# EAGLE schematic bluepill-breakout (EAGLE 9.6.2)

## Sheet 1 of 2
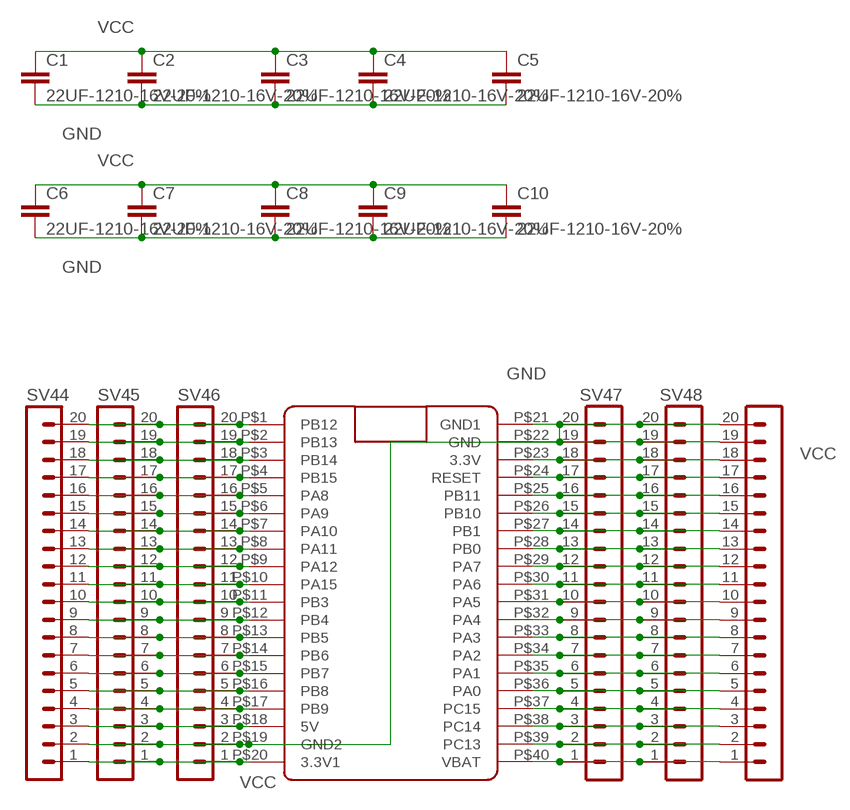
[diagram p0: schematic, sheet 1]

### Parts
C1  22UF-1210-16V-20%  [1210]
C2  22UF-1210-16V-20%  [1210]
C3  22UF-1210-16V-20%  [1210]
C4  22UF-1210-16V-20%  [1210]
C5  22UF-1210-16V-20%  [1210]
C6  22UF-1210-16V-20%  [1210]
C7  22UF-1210-16V-20%  [1210]
C8  22UF-1210-16V-20%  [1210]
C9  22UF-1210-16V-20%  [1210]
C10  22UF-1210-16V-20%  [1210]
SV44  MA20-1  [MA20-1]
SV45  MA20-1  [MA20-1]
SV46  MA20-1  [MA20-1]
SV47  MA20-1  [MA20-1]
SV48  MA20-1  [MA20-1]
SV50  MA20-1  [MA20-1]
U$1  BLUE_PILLADVANCED  [BLUE_PILL_ADV]

### Nets
GND: C1.2 C2.2 C3.2 C4.2 C5.2 C6.2 C7.2 C8.2 C9.2 C10.2 SV44.2 SV45.2 SV46.2 SV47.19 SV47.20 SV48.19 SV48.20 SV50.19 SV50.20 U$1.P$19(GND2) U$1.P$21(GND1) U$1.P$22(GND) ; also sheet 2
N$203: SV44.3 SV45.3 SV46.3 U$1.P$18(5V)
N$204: SV44.4 SV45.4 SV46.4 U$1.P$17(PB9)
N$205: SV44.5 SV45.5 SV46.5 U$1.P$16(PB8)
N$206: SV44.6 SV45.6 SV46.6 U$1.P$15(PB7)
N$207: SV44.7 SV45.7 SV46.7 U$1.P$14(PB6)
N$208: SV44.8 SV45.8 SV46.8 U$1.P$13(PB5)
N$209: SV44.9 SV45.9 SV46.9 U$1.P$12(PB4)
N$210: SV44.10 SV45.10 SV46.10 U$1.P$11(PB3)
N$211: SV44.11 SV45.11 SV46.11 U$1.P$10(PA15)
N$212: SV44.12 SV45.12 SV46.12 U$1.P$9(PA12)
N$213: SV44.13 SV45.13 SV46.13 U$1.P$8(PA11)
N$214: SV44.14 SV45.14 SV46.14 U$1.P$7(PA10)
N$215: SV44.15 SV45.15 SV46.15 U$1.P$6(PA9)
N$216: SV44.16 SV45.16 SV46.16 U$1.P$5(PA8)
N$217: SV44.17 SV45.17 SV46.17 U$1.P$4(PB15)
N$218: SV44.18 SV45.18 SV46.18 U$1.P$3(PB14)
N$219: SV44.19 SV45.19 SV46.19 U$1.P$2(PB13)
N$220: SV44.20 SV45.20 SV46.20 U$1.P$1(PB12)
N$221: SV47.1 SV48.1 SV50.1 U$1.P$40(VBAT)
N$222: SV47.2 SV48.2 SV50.2 U$1.P$39(PC13)
N$223: SV47.3 SV48.3 SV50.3 U$1.P$38(PC14)
N$224: SV47.4 SV48.4 SV50.4 U$1.P$37(PC15)
N$225: SV47.5 SV48.5 SV50.5 U$1.P$36(PA0)
N$226: SV47.6 SV48.6 SV50.6 U$1.P$35(PA1)
N$227: SV47.7 SV48.7 SV50.7 U$1.P$34(PA2)
N$228: SV47.8 SV48.8 SV50.8 U$1.P$33(PA3)
N$229: SV47.9 SV48.9 SV50.9 U$1.P$32(PA4)
N$230: SV47.10 SV48.10 SV50.10 U$1.P$31(PA5)
N$231: SV47.11 SV48.11 SV50.11 U$1.P$30(PA6)
N$232: SV47.12 SV48.12 SV50.12 U$1.P$29(PA7)
N$233: SV47.13 SV48.13 SV50.13 U$1.P$28(PB0)
N$234: SV47.14 SV48.14 SV50.14 U$1.P$27(PB1)
N$235: SV47.15 SV48.15 SV50.15 U$1.P$26(PB10)
N$236: SV47.16 SV48.16 SV50.16 U$1.P$25(PB11)
N$237: SV47.17 SV48.17 SV50.17 U$1.P$24(RESET)
VCC: C1.1 C2.1 C3.1 C4.1 C5.1 C6.1 C7.1 C8.1 C9.1 C10.1 SV44.1 SV45.1 SV46.1 SV47.18 SV48.18 SV50.18 U$1.P$20(3.3V1) U$1.P$23(3.3V) ; also sheet 2

## Sheet 2 of 2
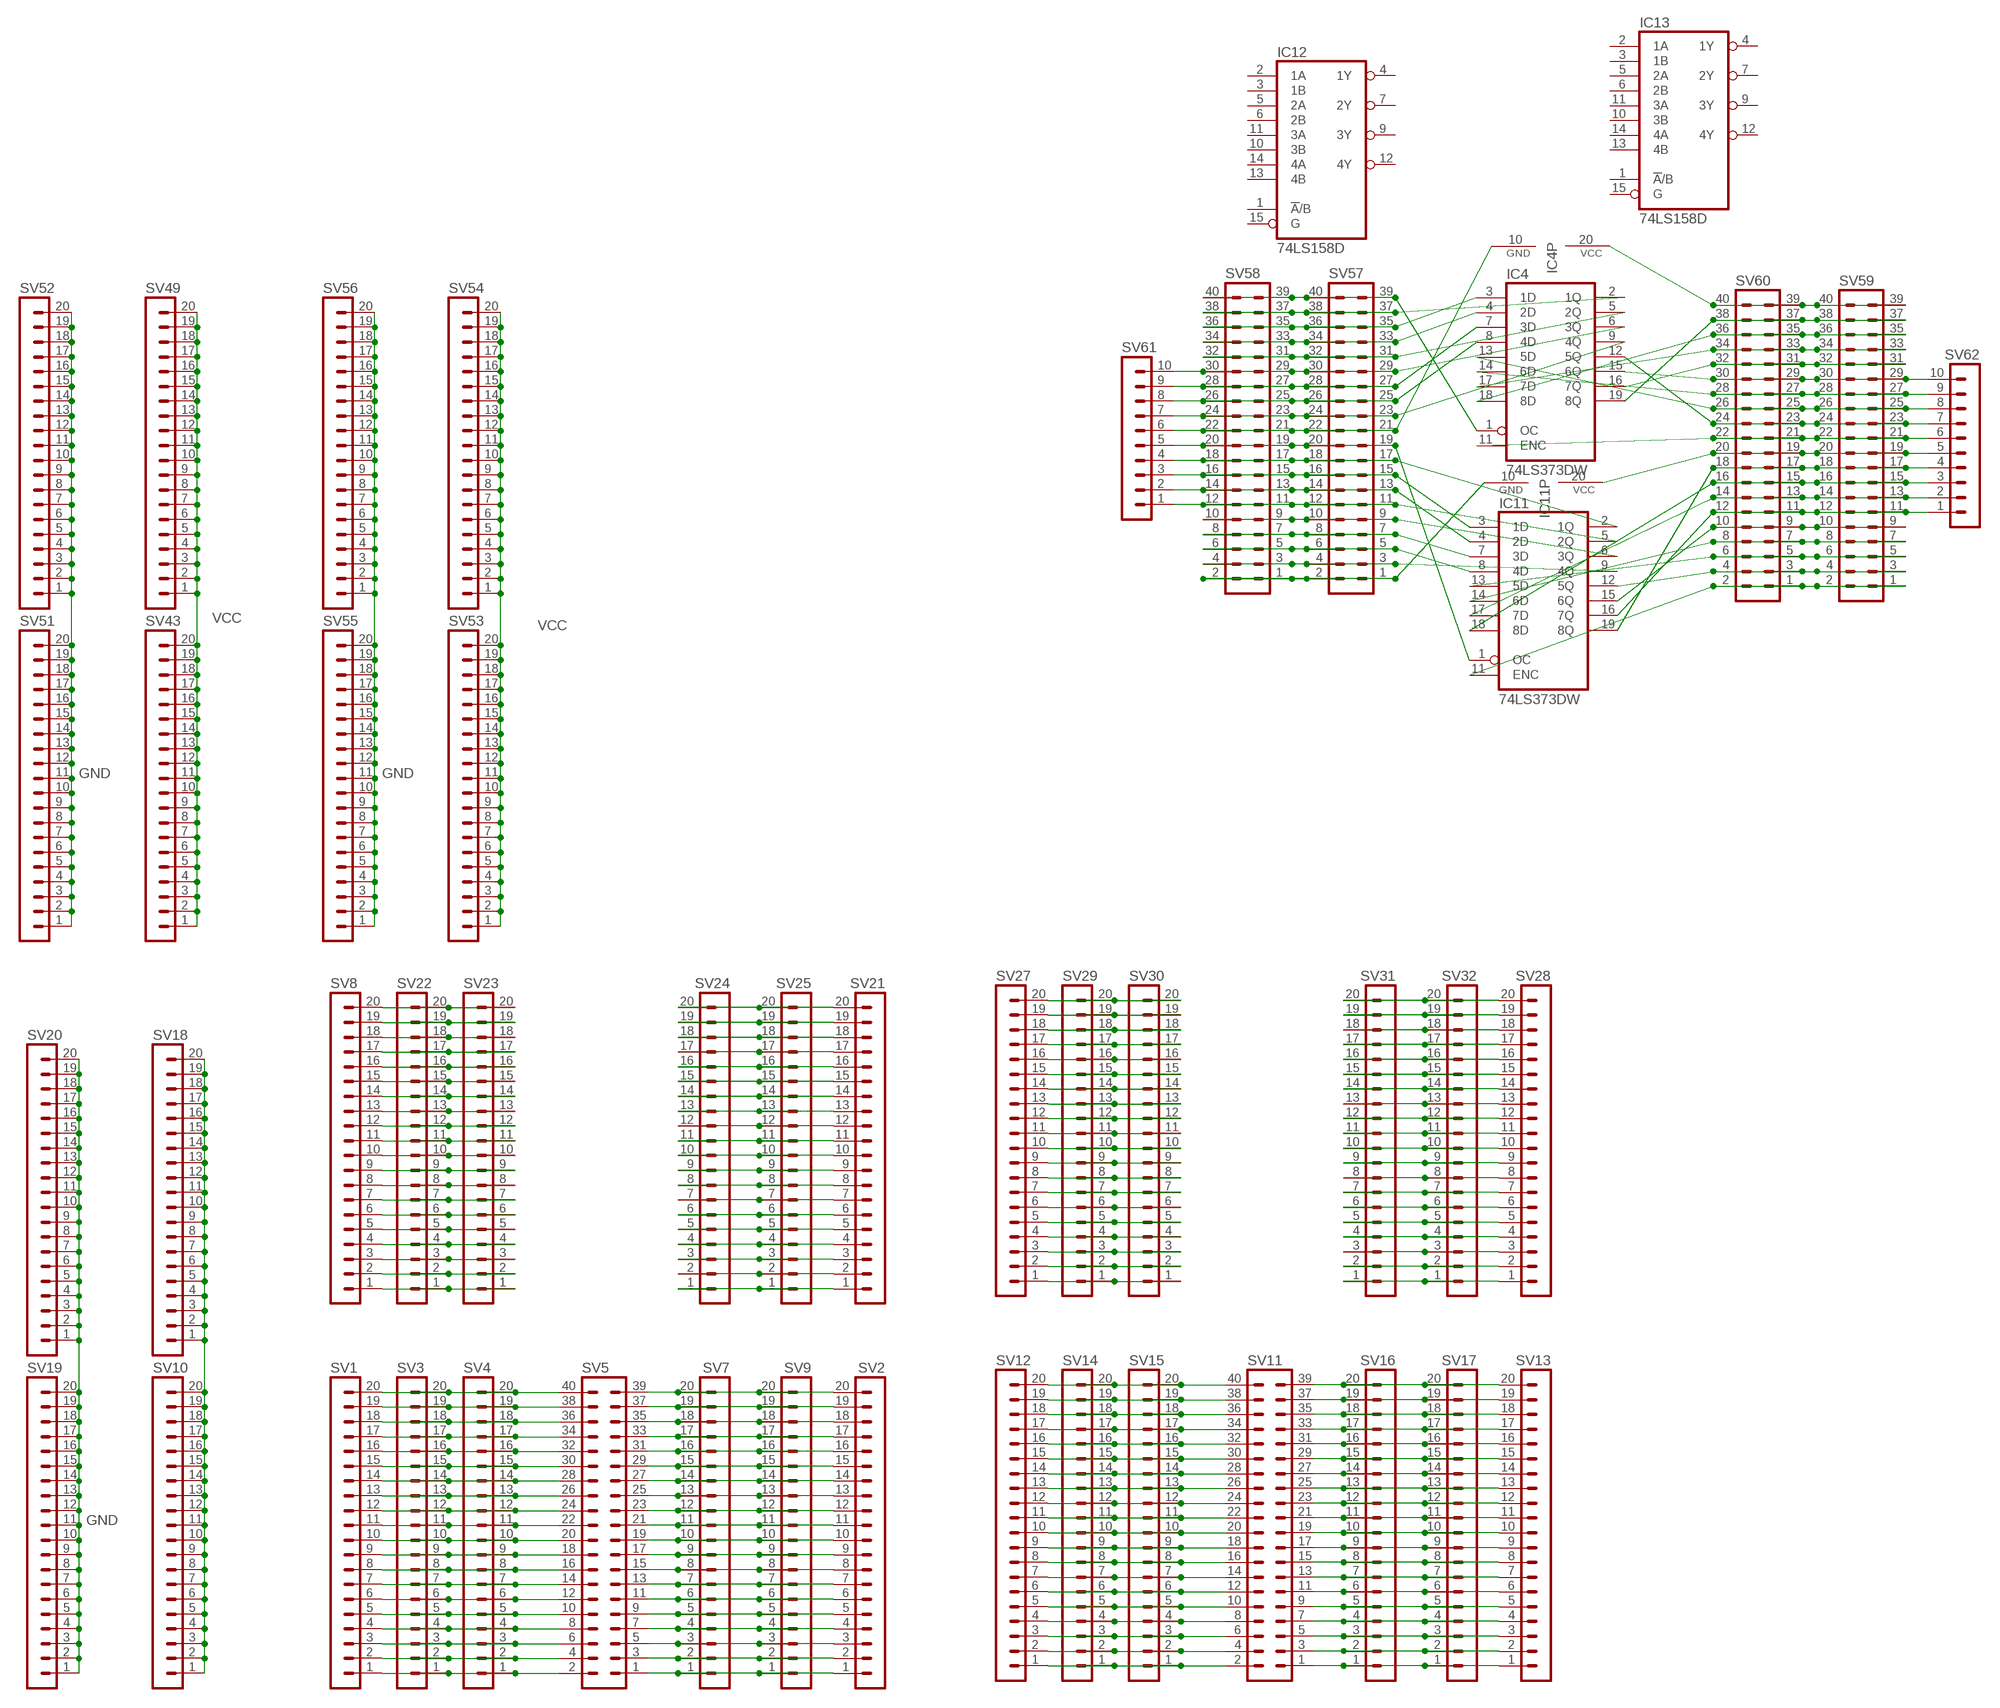
[diagram p1: schematic, sheet 2, part 1 of 2]
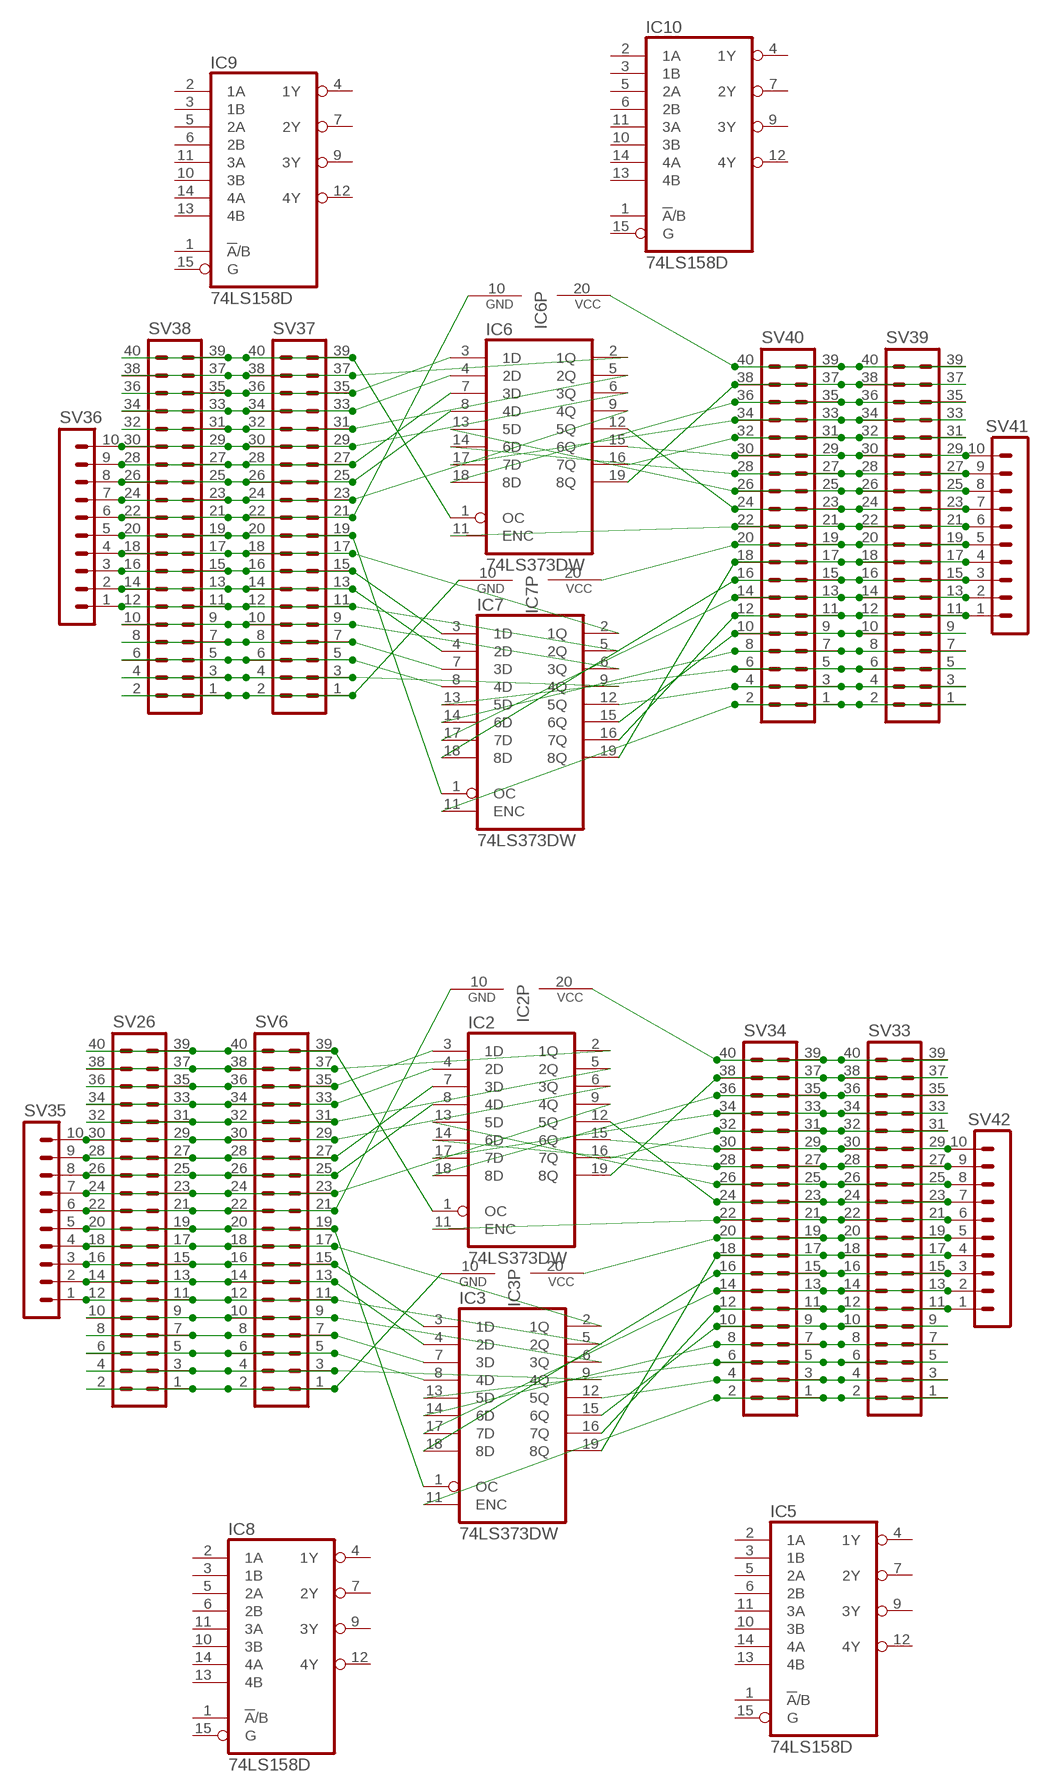
[diagram p2: schematic, sheet 2, part 2 of 2]

### Parts
IC2  74LS373DW  [SO20W]
IC3  74LS373DW  [SO20W]
IC4  74LS373DW  [SO20W]
IC5  74LS158D  [SO16]
IC6  74LS373DW  [SO20W]
IC7  74LS373DW  [SO20W]
IC8  74LS158D  [SO16]
IC9  74LS158D  [SO16]
IC10  74LS158D  [SO16]
IC11  74LS373DW  [SO20W]
IC12  74LS158D  [SO16]
IC13  74LS158D  [SO16]
SV1  MA20-1  [MA20-1]
SV2  MA20-1  [MA20-1]
SV3  MA20-1  [MA20-1]
SV4  MA20-1  [MA20-1]
SV5  MA20-2  [MA20-2]
SV6  MA20-2  [MA20-2]
SV7  MA20-1  [MA20-1]
SV8  MA20-1  [MA20-1]
SV9  MA20-1  [MA20-1]
SV10  MA20-1  [MA20-1]
SV11  MA20-2  [MA20-2]
SV12  MA20-1  [MA20-1]
SV13  MA20-1  [MA20-1]
SV14  MA20-1  [MA20-1]
SV15  MA20-1  [MA20-1]
SV16  MA20-1  [MA20-1]
SV17  MA20-1  [MA20-1]
SV18  MA20-1  [MA20-1]
SV19  MA20-1  [MA20-1]
SV20  MA20-1  [MA20-1]
SV21  MA20-1  [MA20-1]
SV22  MA20-1  [MA20-1]
SV23  MA20-1  [MA20-1]
SV24  MA20-1  [MA20-1]
SV25  MA20-1  [MA20-1]
SV26  MA20-2  [MA20-2]
SV27  MA20-1  [MA20-1]
SV28  MA20-1  [MA20-1]
SV29  MA20-1  [MA20-1]
SV30  MA20-1  [MA20-1]
SV31  MA20-1  [MA20-1]
SV32  MA20-1  [MA20-1]
SV33  MA20-2  [MA20-2]
SV34  MA20-2  [MA20-2]
SV35  MA10-1  [MA10-1]
SV36  MA10-1  [MA10-1]
SV37  MA20-2  [MA20-2]
SV38  MA20-2  [MA20-2]
SV39  MA20-2  [MA20-2]
SV40  MA20-2  [MA20-2]
SV41  MA10-1  [MA10-1]
SV42  MA10-1  [MA10-1]
SV43  MA20-1  [MA20-1]
SV49  MA20-1  [MA20-1]
SV51  MA20-1  [MA20-1]
SV52  MA20-1  [MA20-1]
SV53  MA20-1  [MA20-1]
SV54  MA20-1  [MA20-1]
SV55  MA20-1  [MA20-1]
SV56  MA20-1  [MA20-1]
SV57  MA20-2  [MA20-2]
SV58  MA20-2  [MA20-2]
SV59  MA20-2  [MA20-2]
SV60  MA20-2  [MA20-2]
SV61  MA10-1  [MA10-1]
SV62  MA10-1  [MA10-1]

### Nets
GND: SV19.1 SV19.2 SV19.3 SV19.4 SV19.5 SV19.6 SV19.7 SV19.8 SV19.9 SV19.10 SV19.11 SV19.12 SV19.13 SV19.14 SV19.15 SV19.16 SV19.17 SV19.18 SV19.19 SV19.20 SV20.1 SV20.2 SV20.3 SV20.4 SV20.5 SV20.6 SV20.7 SV20.8 SV20.9 SV20.10 SV20.11 SV20.12 SV20.13 SV20.14 SV20.15 SV20.16 SV20.17 SV20.18 SV20.19 SV20.20 SV51.1 SV51.2 SV51.3 SV51.4 SV51.5 SV51.6 SV51.7 SV51.8 SV51.9 SV51.10 SV51.11 SV51.12 SV51.13 SV51.14 SV51.15 SV51.16 SV51.17 SV51.18 SV51.19 SV51.20 SV52.1 SV52.2 SV52.3 SV52.4 SV52.5 SV52.6 SV52.7 SV52.8 SV52.9 SV52.10 SV52.11 SV52.12 SV52.13 SV52.14 SV52.15 SV52.16 SV52.17 SV52.18 SV52.19 SV52.20 SV55.1 SV55.2 SV55.3 SV55.4 SV55.5 SV55.6 SV55.7 SV55.8 SV55.9 SV55.10 SV55.11 SV55.12 SV55.13 SV55.14 SV55.15 SV55.16 SV55.17 SV55.18 SV55.19 SV55.20 SV56.1 SV56.2 SV56.3 SV56.4 SV56.5 SV56.6 SV56.7 SV56.8 SV56.9 SV56.10 SV56.11 SV56.12 SV56.13 SV56.14 SV56.15 SV56.16 SV56.17 SV56.18 SV56.19 SV56.20 ; also sheet 1
N$1: SV1.1 SV3.1 SV4.1 SV5.2
N$2: SV1.2 SV3.2 SV4.2 SV5.4
N$3: SV1.3 SV3.3 SV4.3 SV5.6
N$4: SV1.4 SV3.4 SV4.4 SV5.8
N$5: SV1.5 SV3.5 SV4.5 SV5.10
N$6: SV1.6 SV3.6 SV4.6 SV5.12
N$7: SV1.7 SV3.7 SV4.7 SV5.14
N$8: SV1.8 SV3.8 SV4.8 SV5.16
N$9: SV1.9 SV3.9 SV4.9 SV5.18
N$10: SV1.10 SV3.10 SV4.10 SV5.20
N$11: SV1.11 SV3.11 SV4.11 SV5.22
N$12: SV1.12 SV3.12 SV4.12 SV5.24
N$13: SV1.13 SV3.13 SV4.13 SV5.26
N$14: SV1.14 SV3.14 SV4.14 SV5.28
N$15: SV1.15 SV3.15 SV4.15 SV5.30
N$16: SV1.16 SV3.16 SV4.16 SV5.32
N$17: SV1.17 SV3.17 SV4.17 SV5.34
N$18: SV1.18 SV3.18 SV4.18 SV5.36
N$19: SV1.19 SV3.19 SV4.19 SV5.38
N$20: SV1.20 SV3.20 SV4.20 SV5.40
N$21: SV2.1 SV5.1 SV7.1 SV9.1
N$22: SV2.2 SV5.3 SV7.2 SV9.2
N$23: SV2.3 SV5.5 SV7.3 SV9.3
N$24: SV2.4 SV5.7 SV7.4 SV9.4
N$25: SV2.5 SV5.9 SV7.5 SV9.5
N$26: SV2.6 SV5.11 SV7.6 SV9.6
N$27: SV2.7 SV5.13 SV7.7 SV9.7
N$28: SV2.8 SV5.15 SV7.8 SV9.8
N$29: SV2.9 SV5.17 SV7.9 SV9.9
N$30: SV2.10 SV5.19 SV7.10 SV9.10
N$31: SV2.11 SV5.21 SV7.11 SV9.11
N$32: SV2.12 SV5.23 SV7.12 SV9.12
N$33: SV2.13 SV5.25 SV7.13 SV9.13
N$34: SV2.14 SV5.27 SV7.14 SV9.14
N$35: SV2.15 SV5.29 SV7.15 SV9.15
N$36: SV2.16 SV5.31 SV7.16 SV9.16
N$37: SV2.17 SV5.33 SV7.17 SV9.17
N$38: SV2.18 SV5.35 SV7.18 SV9.18
N$39: SV2.19 SV5.37 SV7.19 SV9.19
N$40: SV2.20 SV5.39 SV7.20 SV9.20
N$41: SV11.2 SV12.1 SV14.1 SV15.1
N$42: SV11.4 SV12.2 SV14.2 SV15.2
N$43: SV11.6 SV12.3 SV14.3 SV15.3
N$44: SV11.8 SV12.4 SV14.4 SV15.4
N$45: SV11.10 SV12.5 SV14.5 SV15.5
N$46: SV11.12 SV12.6 SV14.6 SV15.6
N$47: SV11.14 SV12.7 SV14.7 SV15.7
N$48: SV11.16 SV12.8 SV14.8 SV15.8
N$49: SV11.18 SV12.9 SV14.9 SV15.9
N$50: SV11.20 SV12.10 SV14.10 SV15.10
N$51: SV11.22 SV12.11 SV14.11 SV15.11
N$52: SV11.24 SV12.12 SV14.12 SV15.12
N$53: SV11.26 SV12.13 SV14.13 SV15.13
N$54: SV11.28 SV12.14 SV14.14 SV15.14
N$55: SV11.30 SV12.15 SV14.15 SV15.15
N$56: SV11.32 SV12.16 SV14.16 SV15.16
N$57: SV11.34 SV12.17 SV14.17 SV15.17
N$58: SV11.36 SV12.18 SV14.18 SV15.18
N$59: SV11.38 SV12.19 SV14.19 SV15.19
N$60: SV11.40 SV12.20 SV14.20 SV15.20
N$61: SV11.1 SV13.1 SV16.1 SV17.1
N$62: SV11.3 SV13.2 SV16.2 SV17.2
N$63: SV11.5 SV13.3 SV16.3 SV17.3
N$64: SV11.7 SV13.4 SV16.4 SV17.4
N$65: SV11.9 SV13.5 SV16.5 SV17.5
N$66: SV11.11 SV13.6 SV16.6 SV17.6
N$67: SV11.13 SV13.7 SV16.7 SV17.7
N$68: SV11.15 SV13.8 SV16.8 SV17.8
N$69: SV11.17 SV13.9 SV16.9 SV17.9
N$70: SV11.19 SV13.10 SV16.10 SV17.10
N$71: SV11.21 SV13.11 SV16.11 SV17.11
N$72: SV11.23 SV13.12 SV16.12 SV17.12
N$73: SV11.25 SV13.13 SV16.13 SV17.13
N$74: SV11.27 SV13.14 SV16.14 SV17.14
N$75: SV11.29 SV13.15 SV16.15 SV17.15
N$76: SV11.31 SV13.16 SV16.16 SV17.16
N$77: SV11.33 SV13.17 SV16.17 SV17.17
N$78: SV11.35 SV13.18 SV16.18 SV17.18
N$79: SV11.37 SV13.19 SV16.19 SV17.19
N$80: SV11.39 SV13.20 SV16.20 SV17.20
N$81: SV8.1 SV22.1 SV23.1
N$82: SV8.2 SV22.2 SV23.2
N$83: SV8.3 SV22.3 SV23.3
N$84: SV8.4 SV22.4 SV23.4
N$85: SV8.5 SV22.5 SV23.5
N$86: SV8.6 SV22.6 SV23.6
N$87: SV8.7 SV22.7 SV23.7
N$88: SV8.8 SV22.8 SV23.8
N$89: SV8.9 SV22.9 SV23.9
N$90: SV8.10 SV22.10 SV23.10
N$91: SV8.11 SV22.11 SV23.11
N$92: SV8.12 SV22.12 SV23.12
N$93: SV8.13 SV22.13 SV23.13
N$94: SV8.14 SV22.14 SV23.14
N$95: SV8.15 SV22.15 SV23.15
N$96: SV8.16 SV22.16 SV23.16
N$97: SV8.17 SV22.17 SV23.17
N$98: SV8.18 SV22.18 SV23.18
N$99: SV8.19 SV22.19 SV23.19
N$100: SV8.20 SV22.20 SV23.20
N$101: SV21.1 SV24.1 SV25.1
N$102: SV21.2 SV24.2 SV25.2
N$103: SV21.3 SV24.3 SV25.3
N$104: SV21.4 SV24.4 SV25.4
N$105: SV21.5 SV24.5 SV25.5
N$106: SV21.6 SV24.6 SV25.6
N$107: SV21.7 SV24.7 SV25.7
N$108: SV21.8 SV24.8 SV25.8
N$109: SV21.9 SV24.9 SV25.9
N$110: SV21.10 SV24.10 SV25.10
N$111: SV21.11 SV24.11 SV25.11
N$112: SV21.12 SV24.12 SV25.12
N$113: SV21.13 SV24.13 SV25.13
N$114: SV21.14 SV24.14 SV25.14
N$115: SV21.15 SV24.15 SV25.15
N$116: SV21.16 SV24.16 SV25.16
N$117: SV21.17 SV24.17 SV25.17
N$118: SV21.18 SV24.18 SV25.18
N$119: SV21.19 SV24.19 SV25.19
N$120: SV21.20 SV24.20 SV25.20
N$121: SV27.1 SV29.1 SV30.1
N$122: SV27.2 SV29.2 SV30.2
N$123: SV27.3 SV29.3 SV30.3
N$124: SV27.4 SV29.4 SV30.4
N$125: SV27.5 SV29.5 SV30.5
N$126: SV27.6 SV29.6 SV30.6
N$127: SV27.7 SV29.7 SV30.7
N$128: SV27.8 SV29.8 SV30.8
N$129: SV27.9 SV29.9 SV30.9
N$130: SV27.10 SV29.10 SV30.10
N$131: SV27.11 SV29.11 SV30.11
N$132: SV27.12 SV29.12 SV30.12
N$133: SV27.13 SV29.13 SV30.13
N$134: SV27.14 SV29.14 SV30.14
N$135: SV27.15 SV29.15 SV30.15
N$136: SV27.16 SV29.16 SV30.16
N$137: SV27.17 SV29.17 SV30.17
N$138: SV27.18 SV29.18 SV30.18
N$139: SV27.19 SV29.19 SV30.19
N$140: SV27.20 SV29.20 SV30.20
N$141: SV28.1 SV31.1 SV32.1
N$142: SV28.2 SV31.2 SV32.2
N$143: SV28.3 SV31.3 SV32.3
N$144: SV28.4 SV31.4 SV32.4
N$145: SV28.5 SV31.5 SV32.5
N$146: SV28.6 SV31.6 SV32.6
N$147: SV28.7 SV31.7 SV32.7
N$148: SV28.8 SV31.8 SV32.8
N$149: SV28.9 SV31.9 SV32.9
N$150: SV28.10 SV31.10 SV32.10
N$151: SV28.11 SV31.11 SV32.11
N$152: SV28.12 SV31.12 SV32.12
N$153: SV28.13 SV31.13 SV32.13
N$154: SV28.14 SV31.14 SV32.14
N$155: SV28.15 SV31.15 SV32.15
N$156: SV28.16 SV31.16 SV32.16
N$157: SV28.17 SV31.17 SV32.17
N$158: SV28.18 SV31.18 SV32.18
N$159: SV28.19 SV31.19 SV32.19
N$160: SV28.20 SV31.20 SV32.20
N$161: IC3.10(GND) SV6.1 SV6.2 SV26.1 SV26.2
N$162: IC3.9(4Q) SV6.3 SV6.4 SV26.3 SV26.4
N$163: IC3.8(4D) SV6.5 SV6.6 SV26.5 SV26.6
N$164: IC3.7(3D) SV6.7 SV6.8 SV26.7 SV26.8
N$165: IC3.6(3Q) SV6.9 SV6.10 SV26.9 SV26.10
N$166: IC3.5(2Q) SV6.11 SV6.12 SV26.11 SV26.12 SV35.1
N$167: IC3.4(2D) SV6.13 SV6.14 SV26.13 SV26.14 SV35.2
N$168: IC3.3(1D) SV6.15 SV6.16 SV26.15 SV26.16 SV35.3
N$169: IC3.2(1Q) SV6.17 SV6.18 SV26.17 SV26.18 SV35.4
N$170: IC3.1(OC) SV6.19 SV6.20 SV26.19 SV26.20 SV35.5
N$171: IC2.10(GND) SV6.21 SV6.22 SV26.21 SV26.22 SV35.6
N$172: IC2.9(4Q) SV6.23 SV6.24 SV26.23 SV26.24 SV35.7
N$173: IC2.8(4D) SV6.25 SV6.26 SV26.25 SV26.26 SV35.8
N$174: IC2.7(3D) SV6.27 SV6.28 SV26.27 SV26.28 SV35.9
N$175: IC2.6(3Q) SV6.29 SV6.30 SV26.29 SV26.30 SV35.10
N$176: IC2.5(2Q) SV6.31 SV6.32 SV26.31 SV26.32
N$177: IC2.4(2D) SV6.33 SV6.34 SV26.33 SV26.34
N$178: IC2.3(1D) SV6.35 SV6.36 SV26.35 SV26.36
N$179: IC2.2(1Q) SV6.37 SV6.38 SV26.37 SV26.38
N$180: IC2.1(OC) SV6.39 SV6.40 SV26.39 SV26.40
N$181: IC3.11(ENC) SV33.1 SV33.2 SV34.1 SV34.2
N$182: IC3.12(5Q) SV33.3 SV33.4 SV34.3 SV34.4
N$183: IC3.13(5D) SV33.5 SV33.6 SV34.5 SV34.6
N$184: IC3.14(6D) SV33.7 SV33.8 SV34.7 SV34.8
N$185: IC3.15(6Q) SV33.9 SV33.10 SV34.9 SV34.10
N$186: IC3.16(7Q) SV33.11 SV33.12 SV34.11 SV34.12 SV42.1
N$187: IC3.17(7D) SV33.13 SV33.14 SV34.13 SV34.14 SV42.2
N$188: IC3.18(8D) SV33.15 SV33.16 SV34.15 SV34.16 SV42.3
N$189: IC3.19(8Q) SV33.17 SV33.18 SV34.17 SV34.18 SV42.4
N$190: IC3.20(VCC) SV33.19 SV33.20 SV34.19 SV34.20 SV42.5
N$191: IC2.11(ENC) SV33.21 SV33.22 SV34.21 SV34.22 SV42.6
N$192: IC2.12(5Q) SV33.23 SV33.24 SV34.23 SV34.24 SV42.7
N$193: IC2.13(5D) SV33.25 SV33.26 SV34.25 SV34.26 SV42.8
N$194: IC2.14(6D) SV33.27 SV33.28 SV34.27 SV34.28 SV42.9
N$195: IC2.15(6Q) SV33.29 SV33.30 SV34.29 SV34.30 SV42.10
N$196: IC2.16(7Q) SV33.31 SV33.32 SV34.31 SV34.32
N$197: IC2.17(7D) SV33.33 SV33.34 SV34.33 SV34.34
N$198: IC2.18(8D) SV33.35 SV33.36 SV34.35 SV34.36
N$199: IC2.19(8Q) SV33.37 SV33.38 SV34.37 SV34.38
N$200: IC2.20(VCC) SV33.39 SV33.40 SV34.39 SV34.40
N$239: IC11.9(4Q) SV57.3 SV57.4 SV58.3 SV58.4
N$241: IC11.7(3D) SV57.7 SV57.8 SV58.7 SV58.8
N$242: IC11.6(3Q) SV57.9 SV57.10 SV58.9 SV58.10
N$243: IC11.5(2Q) SV57.11 SV57.12 SV58.11 SV58.12 SV61.1
N$245: IC11.3(1D) SV57.15 SV57.16 SV58.15 SV58.16 SV61.3
N$246: IC11.2(1Q) SV57.17 SV57.18 SV58.17 SV58.18 SV61.4
N$247: IC11.1(OC) SV57.19 SV57.20 SV58.19 SV58.20 SV61.5
N$248: IC4.10(GND) SV57.21 SV57.22 SV58.21 SV58.22 SV61.6
N$249: IC4.9(4Q) SV57.23 SV57.24 SV58.23 SV58.24 SV61.7
N$251: IC4.7(3D) SV57.27 SV57.28 SV58.27 SV58.28 SV61.9
N$252: IC4.6(3Q) SV57.29 SV57.30 SV58.29 SV58.30 SV61.10
N$253: IC4.5(2Q) SV57.31 SV57.32 SV58.31 SV58.32
N$255: IC4.3(1D) SV57.35 SV57.36 SV58.35 SV58.36
N$256: IC4.2(1Q) SV57.37 SV57.38 SV58.37 SV58.38
N$257: IC4.1(OC) SV57.39 SV57.40 SV58.39 SV58.40
N$258: IC11.11(ENC) SV59.1 SV59.2 SV60.1 SV60.2
N$259: IC11.12(5Q) SV59.3 SV59.4 SV60.3 SV60.4
N$260: IC11.13(5D) SV59.5 SV59.6 SV60.5 SV60.6
N$261: IC11.14(6D) SV59.7 SV59.8 SV60.7 SV60.8
N$262: IC11.15(6Q) SV59.9 SV59.10 SV60.9 SV60.10
N$263: IC11.16(7Q) SV59.11 SV59.12 SV60.11 SV60.12 SV62.1
N$264: IC11.17(7D) SV59.13 SV59.14 SV60.13 SV60.14 SV62.2
N$265: IC11.18(8D) SV59.15 SV59.16 SV60.15 SV60.16 SV62.3
N$266: IC11.19(8Q) SV59.17 SV59.18 SV60.17 SV60.18 SV62.4
N$267: IC11.20(VCC) SV59.19 SV59.20 SV60.19 SV60.20 SV62.5
N$268: IC4.11(ENC) SV59.21 SV59.22 SV60.21 SV60.22 SV62.6
N$269: IC4.12(5Q) SV59.23 SV59.24 SV60.23 SV60.24 SV62.7
N$270: IC4.13(5D) SV59.25 SV59.26 SV60.25 SV60.26 SV62.8
N$271: IC4.14(6D) SV59.27 SV59.28 SV60.27 SV60.28 SV62.9
N$272: IC4.15(6Q) SV59.29 SV59.30 SV60.29 SV60.30 SV62.10
N$273: IC4.16(7Q) SV59.31 SV59.32 SV60.31 SV60.32
N$274: IC4.17(7D) SV59.33 SV59.34 SV60.33 SV60.34
N$275: IC4.18(8D) SV59.35 SV59.36 SV60.35 SV60.36
N$276: IC4.19(8Q) SV59.37 SV59.38 SV60.37 SV60.38
N$278: IC11.10(GND) SV57.1 SV57.2 SV58.1 SV58.2
N$279: IC11.8(4D) SV57.5 SV57.6 SV58.5 SV58.6
N$281: IC11.4(2D) SV57.13 SV57.14 SV58.13 SV58.14 SV61.2
N$284: IC4.8(4D) SV57.25 SV57.26 SV58.25 SV58.26 SV61.8
N$286: IC4.4(2D) SV57.33 SV57.34 SV58.33 SV58.34
N$319: IC4.20(VCC) SV59.39 SV59.40 SV60.39 SV60.40
N$441: IC7.10(GND) SV37.1 SV37.2 SV38.1 SV38.2
N$442: IC7.9(4Q) SV37.3 SV37.4 SV38.3 SV38.4
N$443: IC7.8(4D) SV37.5 SV37.6 SV38.5 SV38.6
N$444: IC7.7(3D) SV37.7 SV37.8 SV38.7 SV38.8
N$445: IC7.6(3Q) SV37.9 SV37.10 SV38.9 SV38.10
N$446: IC7.5(2Q) SV36.1 SV37.11 SV37.12 SV38.11 SV38.12
N$447: IC7.4(2D) SV36.2 SV37.13 SV37.14 SV38.13 SV38.14
N$448: IC7.3(1D) SV36.3 SV37.15 SV37.16 SV38.15 SV38.16
N$449: IC7.2(1Q) SV36.4 SV37.17 SV37.18 SV38.17 SV38.18
N$450: IC7.1(OC) SV36.5 SV37.19 SV37.20 SV38.19 SV38.20
N$451: IC6.10(GND) SV36.6 SV37.21 SV37.22 SV38.21 SV38.22
N$452: IC6.9(4Q) SV36.7 SV37.23 SV37.24 SV38.23 SV38.24
N$453: IC6.8(4D) SV36.8 SV37.25 SV37.26 SV38.25 SV38.26
N$454: IC6.7(3D) SV36.9 SV37.27 SV37.28 SV38.27 SV38.28
N$455: IC6.6(3Q) SV36.10 SV37.29 SV37.30 SV38.29 SV38.30
N$456: IC6.5(2Q) SV37.31 SV37.32 SV38.31 SV38.32
N$457: IC6.4(2D) SV37.33 SV37.34 SV38.33 SV38.34
N$458: IC6.3(1D) SV37.35 SV37.36 SV38.35 SV38.36
N$459: IC6.2(1Q) SV37.37 SV37.38 SV38.37 SV38.38
N$460: IC6.1(OC) SV37.39 SV37.40 SV38.39 SV38.40
N$461: IC7.11(ENC) SV39.1 SV39.2 SV40.1 SV40.2
N$462: IC7.12(5Q) SV39.3 SV39.4 SV40.3 SV40.4
N$463: IC7.13(5D) SV39.5 SV39.6 SV40.5 SV40.6
N$464: IC7.14(6D) SV39.7 SV39.8 SV40.7 SV40.8
N$465: IC7.15(6Q) SV39.9 SV39.10 SV40.9 SV40.10
N$466: IC7.16(7Q) SV39.11 SV39.12 SV40.11 SV40.12 SV41.1
N$467: IC7.17(7D) SV39.13 SV39.14 SV40.13 SV40.14 SV41.2
N$468: IC7.18(8D) SV39.15 SV39.16 SV40.15 SV40.16 SV41.3
N$469: IC7.19(8Q) SV39.17 SV39.18 SV40.17 SV40.18 SV41.4
N$470: IC7.20(VCC) SV39.19 SV39.20 SV40.19 SV40.20 SV41.5
N$471: IC6.11(ENC) SV39.21 SV39.22 SV40.21 SV40.22 SV41.6
N$472: IC6.12(5Q) SV39.23 SV39.24 SV40.23 SV40.24 SV41.7
N$473: IC6.13(5D) SV39.25 SV39.26 SV40.25 SV40.26 SV41.8
N$474: IC6.14(6D) SV39.27 SV39.28 SV40.27 SV40.28 SV41.9
N$475: IC6.15(6Q) SV39.29 SV39.30 SV40.29 SV40.30 SV41.10
N$476: IC6.16(7Q) SV39.31 SV39.32 SV40.31 SV40.32
N$477: IC6.17(7D) SV39.33 SV39.34 SV40.33 SV40.34
N$478: IC6.18(8D) SV39.35 SV39.36 SV40.35 SV40.36
N$479: IC6.19(8Q) SV39.37 SV39.38 SV40.37 SV40.38
N$480: IC6.20(VCC) SV39.39 SV39.40 SV40.39 SV40.40
VCC: SV10.1 SV10.2 SV10.3 SV10.4 SV10.5 SV10.6 SV10.7 SV10.8 SV10.9 SV10.10 SV10.11 SV10.12 SV10.13 SV10.14 SV10.15 SV10.16 SV10.17 SV10.18 SV10.19 SV10.20 SV18.1 SV18.2 SV18.3 SV18.4 SV18.5 SV18.6 SV18.7 SV18.8 SV18.9 SV18.10 SV18.11 SV18.12 SV18.13 SV18.14 SV18.15 SV18.16 SV18.17 SV18.18 SV18.19 SV18.20 SV43.1 SV43.2 SV43.3 SV43.4 SV43.5 SV43.6 SV43.7 SV43.8 SV43.9 SV43.10 SV43.11 SV43.12 SV43.13 SV43.14 SV43.15 SV43.16 SV43.17 SV43.18 SV43.19 SV43.20 SV49.1 SV49.2 SV49.3 SV49.4 SV49.5 SV49.6 SV49.7 SV49.8 SV49.9 SV49.10 SV49.11 SV49.12 SV49.13 SV49.14 SV49.15 SV49.16 SV49.17 SV49.18 SV49.19 SV49.20 SV53.1 SV53.2 SV53.3 SV53.4 SV53.5 SV53.6 SV53.7 SV53.8 SV53.9 SV53.10 SV53.11 SV53.12 SV53.13 SV53.14 SV53.15 SV53.16 SV53.17 SV53.18 SV53.19 SV53.20 SV54.1 SV54.2 SV54.3 SV54.4 SV54.5 SV54.6 SV54.7 SV54.8 SV54.9 SV54.10 SV54.11 SV54.12 SV54.13 SV54.14 SV54.15 SV54.16 SV54.17 SV54.18 SV54.19 SV54.20 ; also sheet 1
Unconnected: IC5.1(!A!/B) IC5.2(1A) IC5.3(1B) IC5.4(1Y) IC5.5(2A) IC5.6(2B) IC5.7(2Y) IC5.9(3Y) IC5.10(3B) IC5.11(3A) IC5.12(4Y) IC5.13(4B) IC5.14(4A) IC5.15(G) IC8.1(!A!/B) IC8.2(1A) IC8.3(1B) IC8.4(1Y) IC8.5(2A) IC8.6(2B) IC8.7(2Y) IC8.9(3Y) IC8.10(3B) IC8.11(3A) IC8.12(4Y) IC8.13(4B) IC8.14(4A) IC8.15(G) IC9.1(!A!/B) IC9.2(1A) IC9.3(1B) IC9.4(1Y) IC9.5(2A) IC9.6(2B) IC9.7(2Y) IC9.9(3Y) IC9.10(3B) IC9.11(3A) IC9.12(4Y) IC9.13(4B) IC9.14(4A) IC9.15(G) IC10.1(!A!/B) IC10.2(1A) IC10.3(1B) IC10.4(1Y) IC10.5(2A) IC10.6(2B) IC10.7(2Y) IC10.9(3Y) IC10.10(3B) IC10.11(3A) IC10.12(4Y) IC10.13(4B) IC10.14(4A) IC10.15(G) IC12.1(!A!/B) IC12.2(1A) IC12.3(1B) IC12.4(1Y) IC12.5(2A) IC12.6(2B) IC12.7(2Y) IC12.9(3Y) IC12.10(3B) IC12.11(3A) IC12.12(4Y) IC12.13(4B) IC12.14(4A) IC12.15(G) IC13.1(!A!/B) IC13.2(1A) IC13.3(1B) IC13.4(1Y) IC13.5(2A) IC13.6(2B) IC13.7(2Y) IC13.9(3Y) IC13.10(3B) IC13.11(3A) IC13.12(4Y) IC13.13(4B) IC13.14(4A) IC13.15(G)

## Power pins joined to a net without a drawn wire
GND: IC5.8(GND) IC8.8(GND) IC9.8(GND) IC10.8(GND) IC12.8(GND) IC13.8(GND)
VCC: IC5.16(VCC) IC8.16(VCC) IC9.16(VCC) IC10.16(VCC) IC12.16(VCC) IC13.16(VCC)

## Library data of the parts
C1-C10 = SparkFun-Capacitors:22UF: 22µF ceramic capacitors A capacitor is a passive two-terminal electrical component used to store electrical energy temporarily in an electric field.
IC2-IC4 IC6 IC7 IC11 = 74xx-us:74*373: Octal D type transparent LATCH, edge triggered
IC5 IC8-IC10 IC12 IC13 = 74xx-us:74*158: Quadruple 2-line to 1-line data SELECTOR/MULTIPLEXER
SV1-SV4 SV7-SV10 SV12-SV25 SV27-SV32 SV43-SV56 = con-lstb:MA20-1: PIN HEADER; OC_FARNELL: unknown; OC_NEWARK: unknown
SV5 SV6 SV11 SV26 SV33 SV34 SV37-SV40 SV57-SV60 = con-lstb:MA20-2: PIN HEADER; OC_FARNELL: unknown; OC_NEWARK: unknown
SV35 SV36 SV41 SV42 SV61 SV62 = con-lstb:MA10-1: PIN HEADER; OC_FARNELL: unknown; OC_NEWARK: unknown
U$1 = BluePill:BLUE_PILL